# Altium schematic sheet WireLessPhone_Microcontroller.SchDoc
size 840 x 594 mm; DocumentNumber: ФНКЦ.542321.001 Э3; SheetNumber: 3; Format: A1
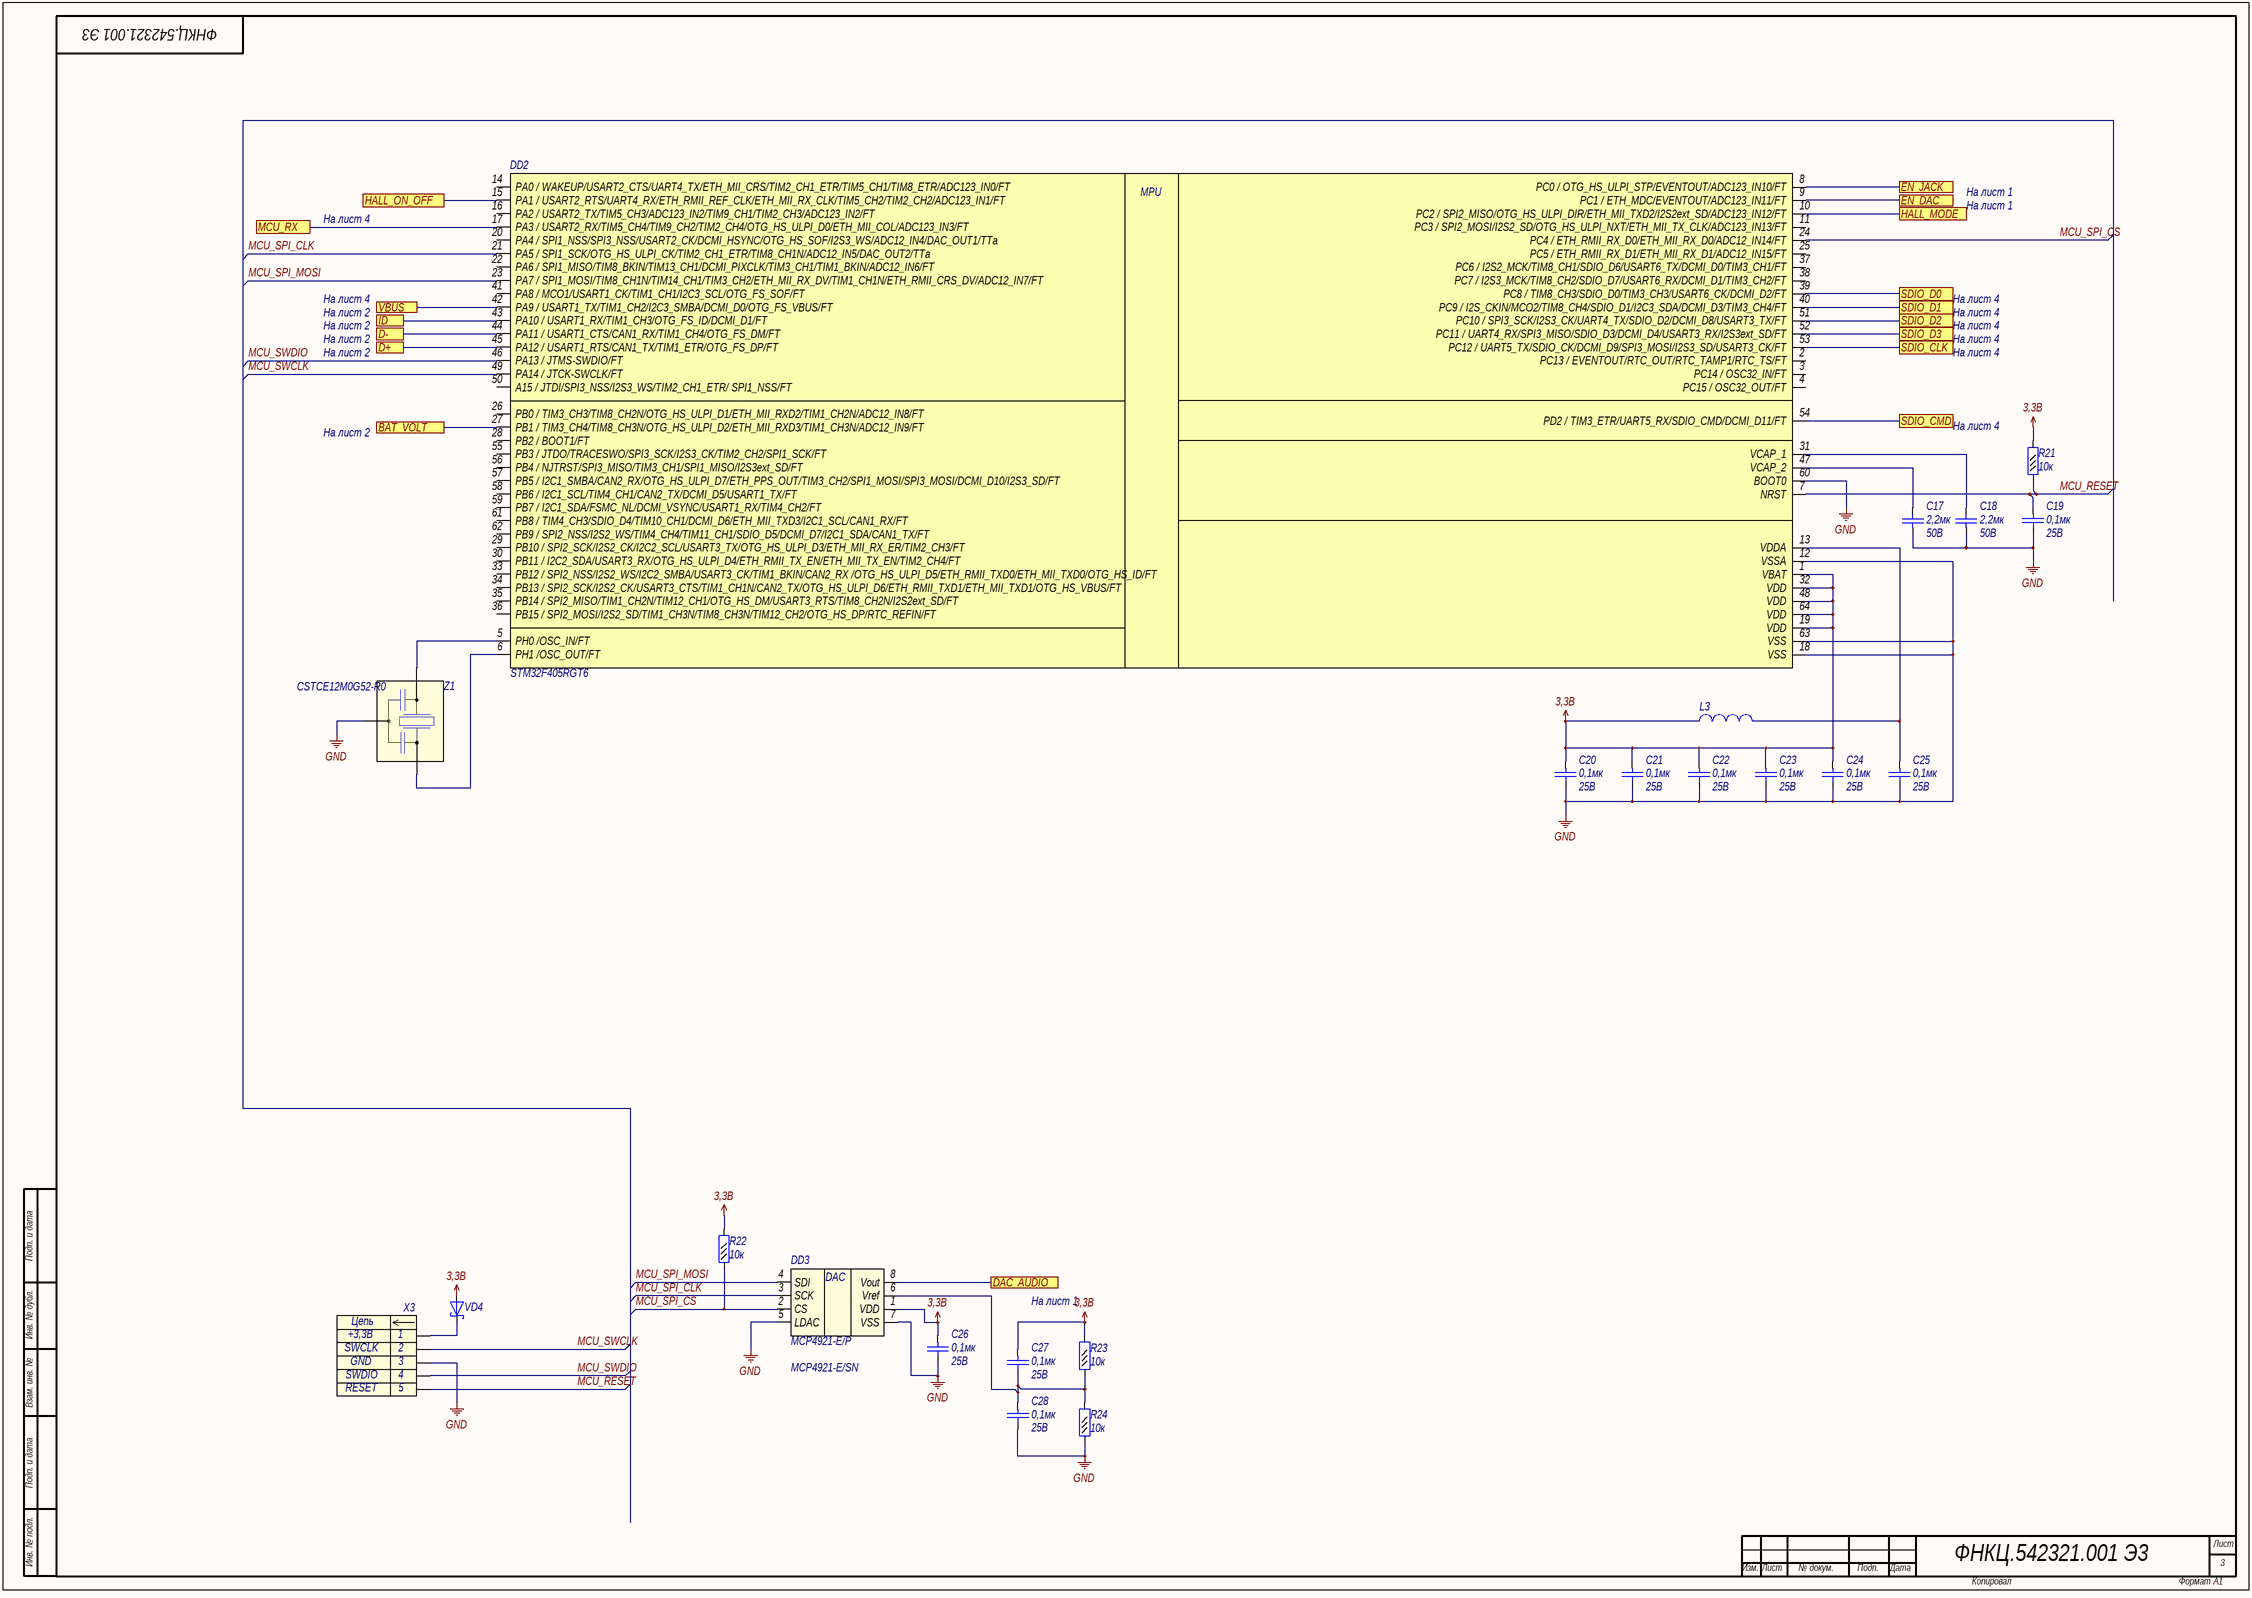
[diagram p0: WireLessPhone_Microcontroller.SchDoc]

## Parts
C17  value 2,2мк  Voltage: 50B  [C0603]  (hidden comment: Capacitor)
C18  value 2,2мк  Voltage: 50B  [C0603]  (hidden comment: Capacitor)
C19  value 0,1мк  Voltage: 25B  [C0402]  (hidden comment: Capacitor)
C20  value 0,1мк  Voltage: 25B  [C0402]  (hidden comment: Capacitor)
C21  value 0,1мк  Voltage: 25B  [C0402]  (hidden comment: Capacitor)
C22  value 0,1мк  Voltage: 25B  [C0402]  (hidden comment: Capacitor)
C23  value 0,1мк  Voltage: 25B  [C0402]  (hidden comment: Capacitor)
C24  value 0,1мк  Voltage: 25B  [C0402]  (hidden comment: Capacitor)
C25  value 0,1мк  Voltage: 25B  [C0402]  (hidden comment: Capacitor)
C26  value 0,1мк  Voltage: 25B  [C0402]  (hidden comment: Capacitor)
C27  value 0,1мк  Voltage: 25B  [C0402]  (hidden comment: Capacitor)
C28  value 0,1мк  Voltage: 25B  [C0402]  (hidden comment: Capacitor)
DD2  STM32F405RGT6  [LQFP64]
DD3  MCP4921-E/P  [SO8]
L3  Inductor  [L0603]  (value not drawn)
R21  value 10к  [R0402]  (hidden comment: Resistor_0,062Вт)
R22  value 10к  [R0402]  (hidden comment: Resistor_0,062Вт)
R23  value 10к  [R0402]  (hidden comment: Resistor_0,062Вт)
R24  value 10к  [R0402]  (hidden comment: Resistor_0,062Вт)
VD4  DiodeSchottky  [SOD-523]  (value not drawn)
X3  Header_5_plg  [PLS-5]  (value not drawn)
Z1  Part Number: CSTCE12M0G52-R0  [CSTCE]  (hidden comment: QuartzWithCaps)

## Ports
BAT_VOLT, D+, D-, DAC_AUDIO, EN_DAC, EN_JACK, HALL_MODE, HALL_ON_OFF, ID, MCU_RX, SDIO_CLK, SDIO_CMD, SDIO_D0, SDIO_D1, SDIO_D2, SDIO_D3, VBUS

## Nets
3,3B: C20.1 C21.1 C22.1 C23.1 C24.1 C26.1 C27.1 DD2.1(VBAT) DD2.19(VDD) DD2.32(VDD) DD2.48(VDD) DD2.64(VDD) DD3.1(VDD) L3.1 R21.2 R22.2 R23.2 VD4.2(A)
GND: C17.1 C18.1 C19.2 C20.2 C21.2 C22.2 C23.2 C24.2 C25.2 C26.2 C28.2 DD2.12(VSSA) DD2.18(VSS) DD2.60(BOOT0) DD2.63(VSS) DD3.5(LDAC) DD3.7(VSS) R24.1 X3.3 Z1.2
BAT_VOLT: DD2.27(PB1_/_TIM3_CH4/TIM8_CH3N/OTG_HS_ULPI_D2/ETH_MII_RXD3/TIM1_CH3N/ADC12_IN9/FT) ; port BAT_VOLT
D+: DD2.45(PA12_/_USART1_RTS/CAN1_TX/TIM1_ETR/OTG_FS_DP/FT) ; port D+
D-: DD2.44(PA11_/_USART1_CTS/CAN1_RX/TIM1_CH4/OTG_FS_DM/FT) ; port D-
DAC_AUDIO: DD3.8(Vout) ; port DAC_AUDIO
EN_DAC: DD2.9(PC1_/_ETH_MDC/EVENTOUT/ADC123_IN11/FT) ; port EN_DAC
EN_JACK: DD2.8(PC0_/_OTG_HS_ULPI_STP/EVENTOUT/ADC123_IN10/FT) ; port EN_JACK
HALL_MODE: DD2.10(PC2_/_SPI2_MISO/OTG_HS_ULPI_DIR/ETH_MII_TXD2/I2S2ext_SD/ADC123_IN12/FT) ; port HALL_MODE
HALL_ON_OFF: DD2.15(PA1_/_USART2_RTS/UART4_RX/ETH_RMII_REF_CLK/ETH_MII_RX_CLK/TIM5_CH2/TIM2_CH2/ADC123_IN1/FT) ; port HALL_ON_OFF
ID: DD2.43(PA10_/_USART1_RX/TIM1_CH3/OTG_FS_ID/DCMI_D1/FT) ; port ID
MCU_RESET: C19.1 DD2.7(NRST) R21.1 X3.5
MCU_RX: DD2.17(PA3_/_USART2_RX/TIM5_CH4/TIM9_CH2/TIM2_CH4/OTG_HS_ULPI_D0/ETH_MII_COL/ADC123_IN3/FT) ; port MCU_RX
MCU_SPI_CLK: DD2.21(PA5_/_SPI1_SCK/OTG_HS_ULPI_CK/TIM2_CH1_ETR/TIM8_CH1N/ADC12_IN5/DAC_OUT2/TTa) DD3.3(SCK)
MCU_SPI_CS: DD2.24(PC4_/_ETH_RMII_RX_D0/ETH_MII_RX_D0/ADC12_IN14/FT) DD3.2(CS) R22.1
MCU_SPI_MOSI: DD2.23(PA7_/_SPI1_MOSI/TIM8_CH1N/TIM14_CH1/TIM3_CH2/ETH_MII_RX_DV/TIM1_CH1N/ETH_RMII_CRS_DV/ADC12_IN7/FT) DD3.4(SDI)
MCU_SWCLK: DD2.49(PA14_/_JTCK-SWCLK/FT) X3.2
MCU_SWDIO: DD2.46(PA13_/_JTMS-SWDIO/FT) X3.4
SDIO_CLK: DD2.53(PC12_/_UART5_TX/SDIO_CK/DCMI_D9/SPI3_MOSI/I2S3_SD/USART3_CK/FT) ; port SDIO_CLK
SDIO_CMD: DD2.54(PD2_/_TIM3_ETR/UART5_RX/SDIO_CMD/DCMI_D11/FT) ; port SDIO_CMD
SDIO_D0: DD2.39(PC8_/_TIM8_CH3/SDIO_D0/TIM3_CH3/USART6_CK/DCMI_D2/FT) ; port SDIO_D0
SDIO_D1: DD2.40(PC9_/_I2S_CKIN/MCO2/TIM8_CH4/SDIO_D1/I2C3_SDA/DCMI_D3/TIM3_CH4/FT) ; port SDIO_D1
SDIO_D2: DD2.51(PC10_/_SPI3_SCK/I2S3_CK/UART4_TX/SDIO_D2/DCMI_D8/USART3_TX/FT) ; port SDIO_D2
SDIO_D3: DD2.52(PC11_/_UART4_RX/SPI3_MISO/SDIO_D3/DCMI_D4/USART3_RX/I2S3ext_SD/FT) ; port SDIO_D3
VBUS: DD2.42(PA9_/_USART1_TX/TIM1_CH2/I2C3_SMBA/DCMI_D0/OTG_FS_VBUS/FT) ; port VBUS
NetC17_2: C17.2 DD2.47(VCAP_2)
NetC18_2: C18.2 DD2.31(VCAP_1)
NetC25_1: C25.1 DD2.13(VDDA) L3.2
NetC27_2: C27.2 C28.1 DD3.6(Vref) R23.1 R24.2
NetDD2_5: DD2.5(PH0_/OSC_IN/FT) Z1.1
NetDD2_6: DD2.6(PH1_/OSC_OUT/FT) Z1.3
NetVD4_1: VD4.1(K) X3.1

Not connected (* = marked no-connect by the designer): DD2 2(PC13_/_EVENTOUT/RTC_OUT/RTC_TAMP1/RTC_TS/FT) 3(PC14_/_OSC32_IN/FT) 4(PC15_/_OSC32_OUT/FT) 11(PC3_/_SPI2_MOSI/I2S2_SD/OTG_HS_ULPI_NXT/ETH_MII_TX_CLK/ADC123_IN13/FT) 14(PA0_/_WAKEUP/USART2_CTS/UART4_TX/ETH_MII_CRS/TIM2_CH1_ETR/TIM5_CH1/TIM8_ETR/ADC123_IN0/FT) 16(PA2_/_USART2_TX/TIM5_CH3/ADC123_IN2/TIM9_CH1/TIM2_CH3/ADC123_IN2/FT) 20(PA4_/_SPI1_NSS/SPI3_NSS/USART2_CK/DCMI_HSYNC/OTG_HS_SOF/I2S3_WS/ADC12_IN4/DAC_OUT1/TTa) 22(PA6_/_SPI1_MISO/TIM8_BKIN/TIM13_CH1/DCMI_PIXCLK/TIM3_CH1/TIM1_BKIN/ADC12_IN6/FT) 25(PC5_/_ETH_RMII_RX_D1/ETH_MII_RX_D1/ADC12_IN15/FT) 26(PB0_/_TIM3_CH3/TIM8_CH2N/OTG_HS_ULPI_D1/ETH_MII_RXD2/TIM1_CH2N/ADC12_IN8/FT) 28(PB2_/_BOOT1/FT) 29(PB10_/_SPI2_SCK/I2S2_CK/I2C2_SCL/USART3_TX/OTG_HS_ULPI_D3/ETH_MII_RX_ER/TIM2_CH3/FT) 30(PB11_/_I2C2_SDA/USART3_RX/OTG_HS_ULPI_D4/ETH_RMII_TX_EN/ETH_MII_TX_EN/TIM2_CH4/FT) 33(PB12_/_SPI2_NSS/I2S2_WS/I2C2_SMBA/USART3_CK/TIM1_BKIN/CAN2_RX_/OTG_HS_ULPI_D5/ETH_RMII_TXD0/ETH_MII_TXD0/OTG_HS_ID/FT) 34(PB13_/_SPI2_SCK/I2S2_CK/USART3_CTS/TIM1_CH1N/CAN2_TX/OTG_HS_ULPI_D6/ETH_RMII_TXD1/ETH_MII_TXD1/OTG_HS_VBUS/FT) 35(PB14_/_SPI2_MISO/TIM1_CH2N/TIM12_CH1/OTG_HS_DM/USART3_RTS/TIM8_CH2N/I2S2ext_SD/FT) 36(PB15_/_SPI2_MOSI/I2S2_SD/TIM1_CH3N/TIM8_CH3N/TIM12_CH2/OTG_HS_DP/RTC_REFIN/FT) 37(PC6_/_I2S2_MCK/TIM8_CH1/SDIO_D6/USART6_TX/DCMI_D0/TIM3_CH1/FT) 38(PC7_/_I2S3_MCK/TIM8_CH2/SDIO_D7/USART6_RX/DCMI_D1/TIM3_CH2/FT) 41(PA8_/_MCO1/USART1_CK/TIM1_CH1/I2C3_SCL/OTG_FS_SOF/FT) 50(A15_/_JTDI/SPI3_NSS/I2S3_WS/TIM2_CH1_ETR/_SPI1_NSS/FT) 55(PB3_/_JTDO/TRACESWO/SPI3_SCK/I2S3_CK/TIM2_CH2/SPI1_SCK/FT) 56(PB4_/_NJTRST/SPI3_MISO/TIM3_CH1/SPI1_MISO/I2S3ext_SD/FT) 57(PB5_/_I2C1_SMBA/CAN2_RX/OTG_HS_ULPI_D7/ETH_PPS_OUT/TIM3_CH2/SPI1_MOSI/SPI3_MOSI/DCMI_D10/I2S3_SD/FT) 58(PB6_/_I2C1_SCL/TIM4_CH1/CAN2_TX/DCMI_D5/USART1_TX/FT) 59(PB7_/_I2C1_SDA/FSMC_NL/DCMI_VSYNC/USART1_RX/TIM4_CH2/FT) 61(PB8_/_TIM4_CH3/SDIO_D4/TIM10_CH1/DCMI_D6/ETH_MII_TXD3/I2C1_SCL/CAN1_RX/FT) 62(PB9_/_SPI2_NSS/I2S2_WS/TIM4_CH4/TIM11_CH1/SDIO_D5/DCMI_D7/I2C1_SDA/CAN1_TX/FT)

## Notes on the sheet
- На лист 1
- На лист 4
- На лист 2
- Подп. и дата
- Инв. № дубл.
- Взам. инв. №
- MCP4921-E/SN
- Инв. № подл.
- Лист
- Изм.
- № докум.
- Подп.
- Дата
- Копировал
- Формат
- (in symbol connect6) Цепь
- (in symbol interf10) DAC
- (in symbol microcont10) MPU

## Library data of the parts
C17 C18 = cap135: Конденсатор; Part Name: Ceramic; Manufacture: Murata; Part Number: GRM188R71A225KE15D; id: cap135; TKE: X7R
C19-C28 = cap52: Конденсатор; Part Name: Ceramic; Manufacture: Murata; Part Number: GRM155F51E104Z**; id: cap52; TKE: Y5V
DD2 = microcont10: Part Name: Microcontroller; Frequency: 168MHz; ADC: 16x12b/2x12b; Interface: can, i2c, irda, lin, spi, uart, usbotg,sdio; Flash: 1Mb; Pin in: 51; Power Supply: 1.8-3.6V; id: microcont10; Part Number: STM32F405RGT6
DD3 = interf10: 12-Bit DAC with SPI™ Interface; Part Name: DAC - SPI Rail-to-Rail; Manufacture: Microchip; Resolution: 12bit; Number of Channel: 2; Vref output: yes; Type Supply: Single Polar; Power Supply: 2.7-5.5V; id: interf10; Part Number: MCP4921-E/P
L3 = ind0: EMI Suppression Filter; Part Name: EMI Suppression Filters; Part Number: BLM18PG181SN1D; Rated Current: 1,5A; id: ind0; Resistance: 0,09Ohm
R21-R24 = res290: Резистор; Manufacture: Yageo; Part Number: RC0402FR-0710KL; id: res290; Accuracy: 1%; Part Name: Resistor; Power: 0,062Вт
VD4 = diode21: Диод Шоттки; Part Number: PMEG2010AEB.115; Manufacture: NXP Semiconductor; Max Reverse Voltage: 20B; Forward Voltage: 0,62B; Forward Current: 1А; Breakdown Current: 600uA; Capacitance: 25pF; Number of Channels: 1; id: diode21; Part Name: Diode Schottky
X3 = connect6: Разъем - 5 конт. вилка; Part Number: DS1021-1*5SF112-B; Manufacture: Ningbo connfly electronic; Contact_1: +3,3B; Contact_2: SWCLK; Contact_3: GND; Contact_4: SWDIO; Contact_5: RESET; Etch: 2,54mm; Part Name: PLS-5; id: connect6
Z1 = crystal5: Кварцевый резорнатор со встроенными нагрузочными конденсаторами; Manufacture: Murata; Frequence: 12MHz; id: crystal5